# EAGLE design passive-optothing (EAGLE 7.7.0)
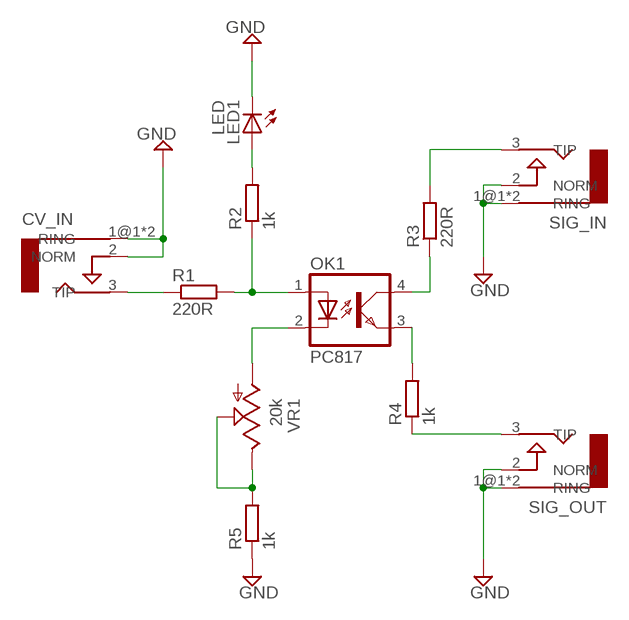
[diagram p0: schematic, sheet 1]

## Parts
CV_IN  AUDIO-JACKERTHENVAR  [ERTHENVAR-JACK]
LED1  LED  LEDCHIPLED_0805  [CHIPLED_0805]
OK1  PC817  [DIL04]
R1  220R  R-EU_R0805  [R0805]
R2  1k  R-EU_R0805  [R0805]
R3  220R  R-EU_R0805  [R0805]
R4  1k  R-EU_R0805  [R0805]
R5  1k  R-EU_R0805  [R0805]
SIG_IN  AUDIO-JACKERTHENVAR  [ERTHENVAR-JACK]
SIG_OUT  AUDIO-JACKERTHENVAR  [ERTHENVAR-JACK]
VR1  20k  9MM_SNAP-IN_POT_  [9MM_SNAP-IN_POT]

## Nets
CV_IN: OK1.1(A) R1.2 R2.1
CV_OUT: OK1.2(C) VR1.1(A)
GND: CV_IN.1@1(RING) CV_IN.1@2(RING) CV_IN.2(NORM) LED1.C R5.1 SIG_IN.1@1(RING) SIG_IN.1@2(RING) SIG_IN.2(NORM) SIG_OUT.1@1(RING) SIG_OUT.1@2(RING) SIG_OUT.2(NORM)
N$1: R5.2 VR1.2(S) VR1.3(E)
N$6: R4.1 SIG_OUT.3(TIP)
N$9: OK1.4(COL) R3.1
N$10: CV_IN.3(TIP) R1.1
N$12: LED1.A R2.2
SIG_IN: R3.2 SIG_IN.3(TIP)
SIG_OUT: OK1.3(EMIT) R4.2

## Library data of the parts
CV_IN SIG_IN SIG_OUT = erthenvar:AUDIO-JACK: Switching Mono 3.5mm Audio Jack from Erthenvar.
LED1 = led:LED: LED OSRAM: - CHIPLED LG R971, LG N971, LY N971, LG Q971, LY Q971, LO R971, LY R971 LH N974, LH R974 LS Q976, LO Q976, LY Q976 LO Q996 - Hyper CHIPLED LW Q18S LB Q993, LB Q99A, LB R99A - SideLED LS A670, LO A670, LY A670, LG A670, LP A670 LB A673, LV A673, LT A673, LW A673 LH A674 LY A675 LS A676, LA A676, LO A676, LY A676, LW A676 LS A679, LY A679, LG A679 - Hyper Micro SIDELED® LS Y876, LA Y876, LO Y876, LY Y876 LT Y87S - SmartLED LW L88C, LW L88S LB L89C, LB L89S, LG L890 LS L89K, LO L89K, LY L89K LS L896, LA L896, LO L896, LY L896 - TOPLED LS T670, LO T670, LY T670, LG T670, LP T670 LSG T670, LSP T670, LSY T670, LOP T670, LYG T670 LG T671, LOG T671, LSG T671 LB T673, LV T673, LT T673, LW T673 LH T674 LS T676, LA T676, LO T676, LY T676, LB T676, LH T676, LSB T676, LW T676 LB T67C, LV T67C, LT T67C, LS T67K, LO T67K, LY T67K, LW E67C LS E67B, LA E67B, LO E67B, LY E67B, LB E67C, LV E67C, LT E67C LW T67C LS T679, LY T679, LG T679 LS T770, LO T770, LY T770, LG T770, LP T770 LB T773, LV T773, LT T773, LW T773 LH T774 LS E675, LA E675, LY E675, LS T675 LS T776, LA T776, LO T776, LY T776, LB T776 LHGB T686 LT T68C, LB T68C - Hyper Mini TOPLED® LB M676 - Mini TOPLED Santana® LG M470 LS M47K, LO M47K, LY M47K Source: http://www.osram.convergy.de LUXEON: - LUMILED® LXK2-PW12-R00, LXK2-PW12-S00, LXK2-PW14-U00, LXK2-PW14-V00 LXK2-PM12-R00, LXK2-PM12-S00, LXK2-PM14-U00 LXK2-PE12-Q00, LXK2-PE12-R00, LXK2-PE12-S00, LXK2-PE14-T00, LXK2-PE14-U00 LXK2-PB12-K00, LXK2-PB12-L00, LXK2-PB12-M00, LXK2-PB14-N00, LXK2-PB14-P00, LXK2-PB14-Q00 LXK2-PR12-L00, LXK2-PR12-M00, LXK2-PR14-Q00, LXK2-PR14-R00 LXK2-PD12-Q00, LXK2-PD12-R00, LXK2-PD12-S00 LXK2-PH12-R00, LXK2-PH12-S00 LXK2-PL12-P00, LXK2-PL12-Q00, LXK2-PL12-R00 Source: www.luxeon.com KINGBRIGHT: KA-3528ASYC Source: www.kingbright.com
OK1 = optocoupler:PC817: SHARP OPTO COUPLER; MPN: PC817X4J000F; OC_FARNELL: 9707727; OC_NEWARK: 97K7059
R1-R5 = rcl:R-EU_: RESISTOR, European symbol
VR1 = MusicThingModular:9MM_SNAP-IN_POT: 9mm vertical snap-in pot, Alpha / Panasonic style

## Board
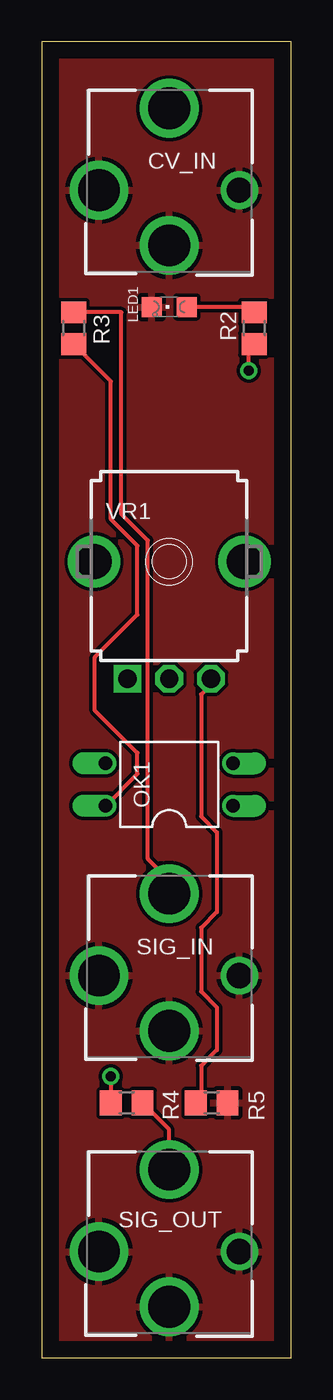
[diagram p1: board, top side]
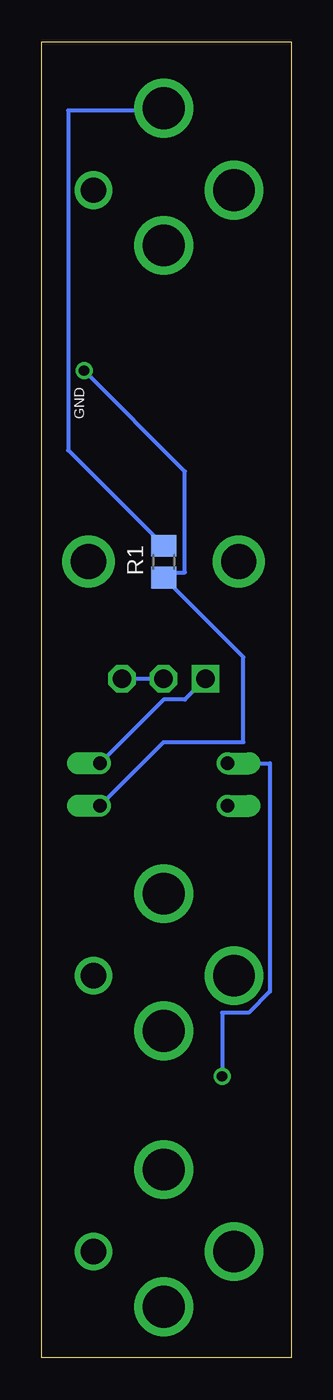
[diagram p2: board, bottom side, seen from below]

Size 14.91 x 78.73 mm. Coordinates in mm from the lower left corner, seen from the top.
Outline: 0,0 14.91,0 14.91,78.73 0,78.73 0,0
Copper layers (1*16): Top 0.035mm / dielectric 1.5mm / Bottom 0.035mm
Design rules "default": minimum track width 10mil, minimum drill 24mil, track to track 8mil, track to pad 8mil, pad to pad 8mil, via to via 8mil, smd to smd 8mil, copper to edge 40mil, drill to drill 8mil, minimum pad ring 10mil, minimum via ring 8mil, stop-mask expansion 4mil, vias tented up to drill 0mil, thermal gap 10mil

### Footprints (pad centres in the part's own frame; a part is rotated, then mirrored left to right if it is on the bottom)
ERTHENVAR-JACK = drill 2.5: 1@1 -4.2,0; 2 0,-3.3; 3 0,4.9 | drill 1.5: 1@2 4.2,0
CHIPLED_0805 = smd 1.2 x 1.2: A 0,-1.05; C 0,1.05
DIL04 = drill 0.813 offset: 1 -1.27,-3.81; 2 1.27,-3.81; 3 1.27,3.81; 4 -1.27,3.81
R0805 = smd 1.3 x 1.5: 1 -0.95,0; 2 0.95,0
9MM_SNAP-IN_POT = drill 1.1 square: 1 -2.5,-7 | drill 1.1 octagon: 2 0,-7; 3 2.5,-7 | drill 2.1 pad 2.794: CHASSIS1 -4.5,0; CHASSIS2 4.5,0

### Placement (x,y rotation side)
CV_IN  7.62,69.85 0 top
LED1  7.62,62.87 90 top
OK1  7.62,34.29 90 top
R1  7.62,47.62 270 bottom
R2  12.7,61.59 90 top
R3  1.91,61.59 90 top
R4  5.08,15.24 180 top
R5  10.16,15.24 180 top
SIG_IN  7.62,22.86 0 top
SIG_OUT  7.62,6.35 0 top
VR1  7.62,47.62 0 top

### Tracks (layer width: path | path; a pad name or v marks a point on that pad's centre or on a via)
CV_IN  (via drill 0.61)
  Top 0.254: v12.38,59.05 12.38,60.33 R2.1
  Bottom 0.254: OK1.1 7.62,36.83 2.86,36.83 2.86,41.91 R1.2 7.62,46.99 6.35,46.99 6.35,53.02 v12.38,59.05
CV_OUT
  Bottom 0.254: OK1.2 7.62,39.37 6.35,39.37 5.4,40.32 VR1.1
GND
  pour Top: 0,78.74 15.24,78.74 15.24,0 0,0
N$1
  Top 0.254: R5.2 9.53,15.24 9.53,17.46 10.48,18.41 10.48,20.95 9.53,21.91 9.53,25.72 10.48,26.67 10.48,31.43 9.53,32.38 9.53,39.69 9.84,40.01 9.84,40.32 VR1.3
  Bottom 0.254: VR1.2 7.62,40.64 9.84,40.64 VR1.3
N$6
  Top 0.254: SIG_OUT.3 7.62,13.65 R4.1
N$9
  Top 0.254: OK1.4 5.71,34.92 5.71,36.2 3.17,38.73 3.17,41.91 5.71,44.45 5.71,48.58 4.13,50.16 4.13,58.42 R3.1
N$10
  Bottom 0.254: R1.1 13.34,54.29 13.34,74.61 7.62,74.61 CV_IN.3
N$12
  Top 0.254: LED1.A 12.7,62.87 R2.2
SIG_IN
  Top 0.254: SIG_IN.3 7.62,28.57 6.35,29.84 6.35,48.9 4.76,50.48 4.76,62.55 R3.2
SIG_OUT  (via drill 0.61)
  Top 0.254: v4.13,16.83 R4.2
  Bottom 0.254: v4.13,16.83 4.13,20.64 2.54,20.64 1.27,21.91 1.27,35.56 OK1.3

### Text on the board
bNames: GND